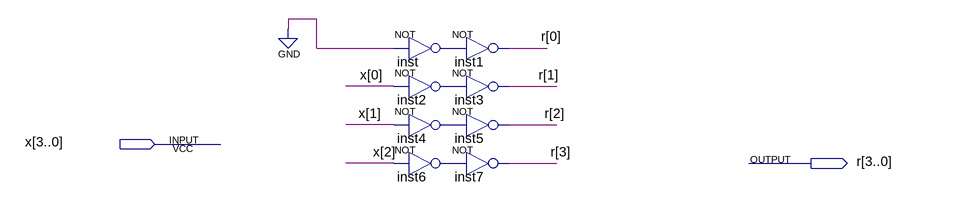
[diagram p0: schematic sheet]
// Quartus schematic mult.bdf as structural Verilog: 8 symbols, 2 pins
module mult (
  input  [3:0] x,
  output [3:0] r
);

  wire inst2_out, inst4_out, inst6_out, inst_out;

  not inst (inst_out, 1'b0);
  not inst2 (inst2_out, x[0]);
  not inst4 (inst4_out, x[1]);
  not inst6 (inst6_out, x[2]);
  not inst1 (r[0], inst_out);
  not inst3 (r[1], inst2_out);
  not inst5 (r[2], inst4_out);
  not inst7 (r[3], inst6_out);
endmodule
